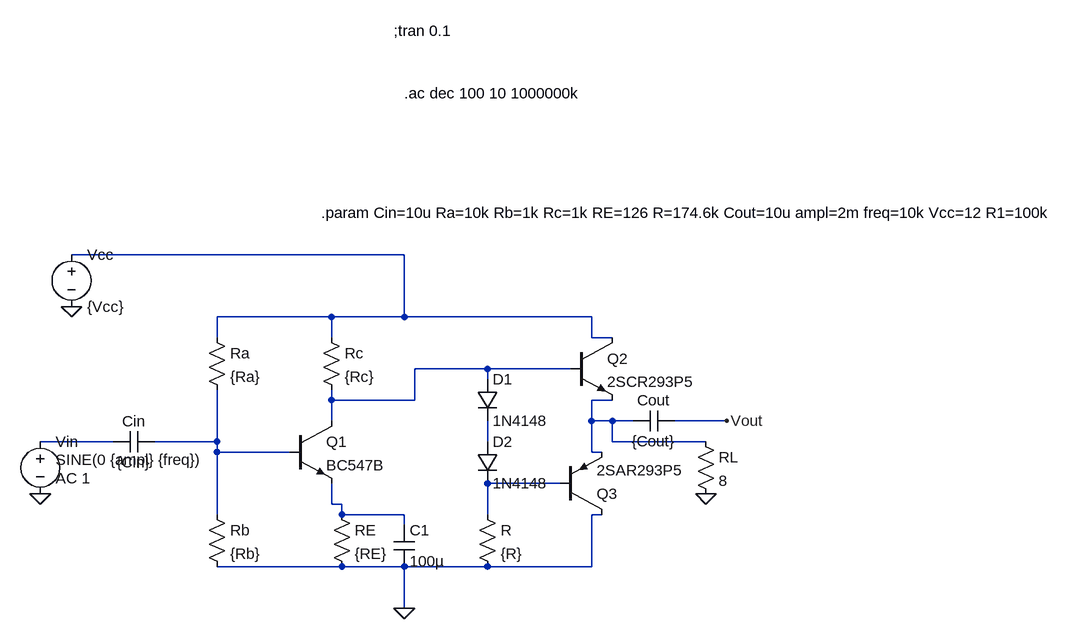
[diagram p0: schematic example.asc]
example.asc, the LTspice schematic file:
Version 4
SHEET 1 1408 680
WIRE -64 -240 -576 -240
WIRE -176 -144 -352 -144
WIRE -64 -144 -64 -240
WIRE -64 -144 -176 -144
WIRE 224 -144 -64 -144
WIRE -352 -112 -352 -144
WIRE -176 -112 -176 -144
WIRE 224 -112 224 -144
WIRE 256 -112 224 -112
WIRE 64 -64 -48 -64
WIRE 192 -64 64 -64
WIRE 64 -48 64 -64
WIRE -176 -16 -176 -32
WIRE -48 -16 -48 -64
WIRE -48 -16 -176 -16
WIRE 256 -16 224 -16
WIRE -176 16 -176 -16
WIRE 224 16 224 -16
WIRE 256 16 224 16
WIRE 288 16 256 16
WIRE 432 16 352 16
WIRE -512 48 -624 48
WIRE -352 48 -352 -32
WIRE -352 48 -448 48
WIRE 64 48 64 16
WIRE 256 48 256 16
WIRE 400 48 256 48
WIRE -352 64 -352 48
WIRE -240 64 -352 64
WIRE 224 64 224 16
WIRE 240 64 224 64
WIRE 176 112 64 112
WIRE -176 144 -176 112
WIRE -160 144 -176 144
WIRE -352 160 -352 64
WIRE -160 160 -160 144
WIRE -64 160 -160 160
WIRE 64 160 64 112
WIRE 240 160 224 160
WIRE -64 176 -64 160
WIRE -160 240 -352 240
WIRE -64 240 -160 240
WIRE 64 240 -64 240
WIRE 224 240 224 160
WIRE 224 240 64 240
WIRE -64 304 -64 240
FLAG 432 16 Vout
FLAG -64 304 0
FLAG -624 128 0
FLAG -576 -160 0
FLAG 400 128 0
SYMBOL res -368 -128 R0
SYMATTR InstName Ra
SYMATTR Value {Ra}
SYMBOL res -368 144 R0
SYMATTR InstName Rb
SYMATTR Value {Rb}
SYMBOL res -192 -128 R0
SYMATTR InstName Rc
SYMATTR Value {Rc}
SYMBOL res -176 144 R0
SYMATTR InstName RE
SYMATTR Value {RE}
SYMBOL res 48 144 R0
SYMATTR InstName R
SYMATTR Value {R}
SYMBOL voltage -576 -256 R0
SYMATTR InstName Vcc
SYMATTR Value {Vcc}
SYMBOL voltage -624 32 R0
WINDOW 3 24 44 Left 2
WINDOW 123 24 72 Left 2
WINDOW 39 0 0 Left 0
SYMATTR Value SINE(0 {ampl} {freq})
SYMATTR Value2 AC 1
SYMATTR InstName Vin
SYMBOL diode 48 -48 R0
SYMATTR InstName D1
SYMATTR Value 1N4148
SYMBOL diode 48 48 R0
SYMATTR InstName D2
SYMATTR Value 1N4148
SYMBOL npn -240 16 R0
SYMATTR InstName Q1
SYMATTR Value BC547B
SYMBOL cap -448 32 R90
WINDOW 0 0 32 VBottom 2
WINDOW 3 32 32 VTop 2
SYMATTR InstName Cin
SYMATTR Value {Cin}
SYMBOL cap 352 0 R90
WINDOW 0 0 32 VBottom 2
WINDOW 3 32 32 VTop 2
SYMATTR InstName Cout
SYMATTR Value {Cout}
SYMBOL res 384 32 R0
SYMATTR InstName RL
SYMATTR Value 8
SYMBOL npn 192 -112 R0
SYMATTR InstName Q2
SYMATTR Value 2SCR293P5
SYMBOL pnp 176 160 M180
SYMATTR InstName Q3
SYMATTR Value 2SAR293P5
SYMBOL cap -80 176 R0
SYMATTR InstName C1
SYMATTR Value 100µ
TEXT -192 -304 Left 2 !.param Cin=10u Ra=10k Rb=1k Rc=1k RE=126 R=174.6k Cout=10u ampl=2m freq=10k Vcc=12 R1=100k
TEXT -80 -584 Left 2 !;tran 0.1
TEXT -64 -488 Left 2 !.ac dec 100 10 1000000k

The netlist it stands for:
* example.asc
Ra N001 N005 {Ra}
Rb N005 0 {Rb}
Rc N001 N002 {Rc}
RE N008 0 {RE}
R N007 0 {R}
Vcc N001 0 {Vcc}
Vin N004 0 SINE(0 {ampl} {freq}) AC 1
D1 N002 N006 1N4148
D2 N006 N007 1N4148
Q1 N002 N005 N008 0 BC547B
Cin N005 N004 {Cin}
Cout Vout N003 {Cout}
RL N003 0 8
Q2 N001 N002 N003 0 2SCR293P5
Q3 0 N007 N003 0 2SAR293P5
C1 N008 0 100µ
.model D D
.lib standard.dio
.model NPN NPN
.model PNP PNP
.lib standard.bjt
.param Cin=10u Ra=10k Rb=1k Rc=1k RE=126 R=174.6k Cout=10u ampl=2m freq=10k Vcc=12 R1=100k
;tran 0.1
.ac dec 100 10 1000000k
.backanno
.end